# Altium schematic sheet Power_Supply.SchDoc: Power Supply
size A4; DrawnBy: hvj10; Organization: ENEL429 Group 9; Address1: ECE Department; Address2: University of Canterbury; Address3: Christchurch 8041; Address4: New Zealand; Revision: 1; SheetNumber: 3; SheetTotal: 5
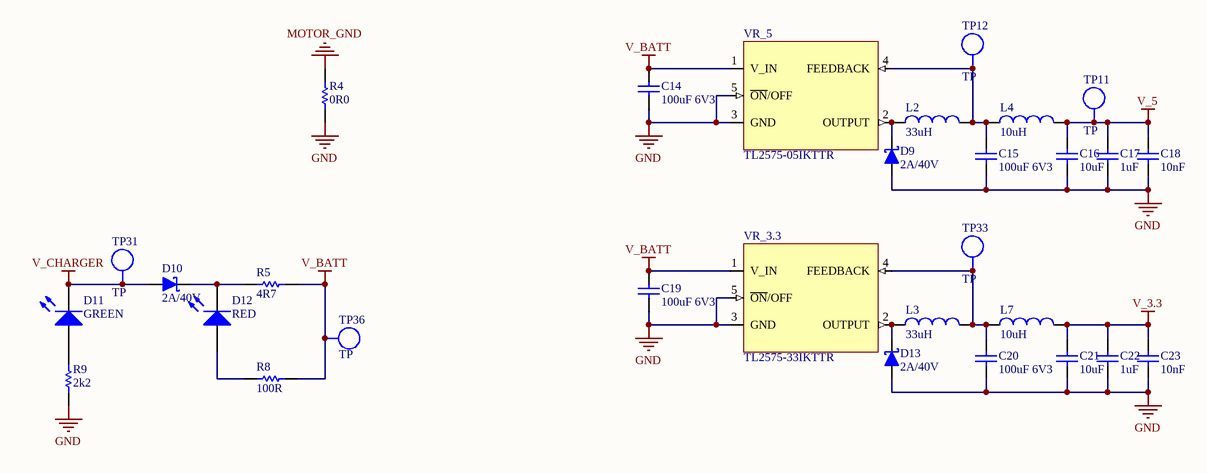
[diagram p0: Power_Supply.SchDoc]

## Parts
C14  100uF 6V3  [1206]
C15  100uF 6V3  [1206]
C16  10uF  [0805]
C17  1uF  [0603]
C18  10nF  [0603]
C19  100uF 6V3  [1206]
C20  100uF 6V3  [1206]
C21  10uF  [0805]
C22  1uF  [0603]
C23  10nF  [0603]
D9  2A/40V  [SMB_DIODE]
D10  2A/40V  [SMB_DIODE]
D11  value GREEN  [DIODE_0805]  (hidden comment: LED Green)
D12  value RED  [Diode_0805]  (hidden comment: LED Red)
D13  2A/40V  [SMB_DIODE]
L2  value 33uH  [DR124]  (hidden comment: Inductor)
L3  value 33uH  [DR124]  (hidden comment: Inductor)
L4  10uH  [WE-PD]
L7  10uH  [WE-PD]
R4  0R0  [0603]  (no BOM)
R5  4R7  [0603]
R8  100R  [0603]
R9  2k2  [0603]
TP11  TP  [TEST_POINT_4X2MM]  (no BOM)
TP12  TP  [TEST_POINT_4X2MM]  (no BOM)
TP31  TP  [TEST_POINT_4X2MM]  (no BOM)
TP33  TP  [TEST_POINT_4X2MM]  (no BOM)
TP36  TP  [TEST_POINT_4X2MM]  (no BOM)
VR_3.3  TL2575-33IKTTR  [TO170P1524X483-6N]
VR_5  TL2575-05IKTTR  [TO170P1524X483-6N]

## Nets
GND: C14.1 C15.1 C16.1 C17.1 C18.1 C19.1 C20.1 C21.1 C22.1 C23.1 D9.1(A) D13.1(A) R4.2 R9.1 VR_3.3.3(GND) VR_3.3.5(~{ON}/OFF) VR_3.3.6(GND) VR_5.3(GND) VR_5.5(~{ON}/OFF) VR_5.6(GND)
MOTOR_GND: R4.1
V_3.3: C21.2 C22.2 C23.2 L7.2
V_5: C16.2 C17.2 C18.2 L4.2 TP11.1
V_BATT: C14.2 C19.2 R5.2 R8.2 TP36.1 VR_3.3.1(V_IN) VR_5.1(V_IN)
V_CHARGER: D10.1(A) D11.2(K) TP31.1
NetC15_2: C15.2 L2.2 L4.1 TP12.1 VR_5.4(FEEDBACK)
NetC20_2: C20.2 L3.2 L7.1 TP33.1 VR_3.3.4(FEEDBACK)
NetD9_2: D9.2(K) L2.1 VR_5.2(OUTPUT)
NetD10_2: D10.2(K) D12.2(K) R5.1
NetD11_1: D11.1(A) R9.2
NetD12_1: D12.1(A) R8.1
NetD13_2: D13.2(K) L3.1 VR_3.3.2(OUTPUT)

## Notes on the sheet
- Title
- Drawn by:
- Date:
- Time:
- Revision:
- Sheet
- of
- File:

## Library data of the parts
C14 C15 C19 C20 = CP_CER 100uF_1206_6V3: 100uF 6.3V 1206 multi-layer ceramic capacitor; Manufacturer PN: C1206C107M9PACTU; Manufacturer: Kemet; Supplier Part Number 1: 399-5620-1-ND; price: 2.56; Supplier 1: Digi-Key; value: 100uF 6V3; Part Number: CP_CER 100uF_1206_6V3; Component Kind: Standard; Component Type: Standard; Designator: CP_CER 100uF_1206_6V3; Pin Count: 2
C16 C21 = CP_10uF 0805: CAP 10uF 10% 10V X5R 0805; Manufacturer: Murata; Manufacturer PN: GRM219R61A106KE44D; LatestRevisionDate: 29 May 08; Supplier 1: Digi-Key; Supplier Part Number 1: 490-4735-1-ND; Value: 10uF; Part Number: CP_10uF 0805; Component Kind: Standard; Component Type: Standard; Designator: CP_10uF 0805; Pin Count: 2
C17 C22 = CP_1uF_50V_0603: CAP CER 1.0UF 50V X7R 0603; Manufacturer: Taiyo Yuden; Manufacturer PN: UMK107C5105KA-T; Supplier Part Number 1: 445-5090-2-ND; Supplier 1: Digi-Key; Value: 1uF; Part Number: CP_1uF_50V_0603; Component Kind: Standard; Component Type: Standard; Designator: CP_1uF_50V_0603; Pin Count: 2; Signal Integrity: Cap; Simulation: CAP
C18 C23 = CP_10nF 0603: CAP CER 10000PF 100V X7R 0603; Manufacturer: Taiyo Yuden; Manufacturer PN: HMK107B7103KA-T; Supplier 1: Digi-Key; Supplier Part Number 1: 587-1446-2-ND; Value: 10nF; Part Number: CP_10nF 0603; Component Kind: Standard; Component Type: Standard; Designator: CP_10nF 0603; Pin Count: 2; Signal Integrity: Cap; Simulation: CAP
D9 D10 D13 = DS_SS230TP: Schottky Diode - 2A/30V; Manufacturer: Discrete Semiconductor Products; Manufacturer PN: SS23; Signal Integrity: D Schottky; LatestRevisionDate: 20 Feb 09; Supplier Part Number 1: SS23-TPMSCT-ND; Supplier 1: Digi-Key; Value: 2A/40V; Part Number: DS_SS230TP; Component Kind: Standard; Component Type: Standard; Designator: DS_SS230TP; Pin Count: 2; Simulation: SKYDIODE
D11 = DL_LED Green 0805: Green LED 0805; Manufacturer: Vishay; Verify: Not checked; Supplier 1: Digi-Key; Supplier Part Number 1: 160-1179-2-ND; Part Number: DL_LED Green 0805; Component Kind: Standard; Component Type: Standard; Designator: DL_LED Green 0805; Footprint: LED_RA_SMD; Pin Count: 2; Simulation: LED0
D12 = DL_LED Red 0805: Red LED 0805; Manufacturer PN: TLMS2100-GS08; Manufacturer: Vishay; Supplier 1: Digi-Key; Supplier Part Number 1: 350-2038-1-ND; Part Number: DL_LED Red 0805; Component Kind: Standard; Component Type: Standard; Designator: DL_LED Red 0805; Pin Count: 2; Simulation: LED0
L2 L3 = IN_33u 2A SMT: INDUCTOR POWER SHIELD 33UH 2.6A SMD; Manufacturer: Coiltronics; Manufacturer PN: DR124-330-R; Verify: Not Checked; LatestRevisionDate: 20 Feb 09; Supplier 1: Digi-Key; Supplier Part Number 1: 513-1435-1-ND; Part Number: IN_33u 2A SMT; Component Kind: Standard; Component Type: Standard; Designator: IN_33u 2A SMT; Pin Count: 2; Signal Integrity: Inductor; Simulation: INDUCTOR
L4 L7 = IN_10uH 2A SMT: INDUCTOR POWER 10UH 2.0A SMD; Manufacturer: Wurth Electronics Inc; Manufacturer PN: 744777910; LatestRevisionDate: 29 May 08; Supplier 1: Digi-Key; Supplier Part Number 1: 732-1191-1-ND; Value: 10uH; Part Number: IN_10uH 2A SMT; Component Kind: Standard; Component Type: Standard; Designator: IN_10uH 2A SMT; Pin Count: 2; Signal Integrity: Inductor; Simulation: INDUCTOR
R4 = RS_0R0 0603: RES 0.0 OHM 1/10W 5% 0603 SMD; Manufacturer: Rohm; Manufacturer PN: MCR03EZPJ000; LatestRevisionDate: 3 Jun 08; Supplier 1: Digi-Key; Supplier Part Number 1: RHM0.0GTR-ND; Value: 0R0; Part Number: RS_0R0 0603; Component Type: Standard (No BOM); Designator: RS_0R0 0603; Pin Count: 2; Signal Integrity: Res; Simulation: RESISTOR
R5 = RS_4R7_0603: RES 4.7R 1/10W 5% 0603 SMD; Manufacturer: Yageo; Manufacturer PN: RC0603JR-074R7L; Verify: Not Checked; LatestRevisionDate: 20 Feb 09; Supplier 1: Digi-Key; Supplier Part Number 1: 311-4.7GRTR-ND; Value: 4R7; Part Number: RS_4R7_0603; Component Kind: Standard; Component Type: Standard; Designator: RS_4R7_0603; Pin Count: 2; Signal Integrity: Res; Simulation: RESISTOR
R8 = RS_100R 0603: RES 100 OHM 1/10W 1% 0603 SMD; Manufacturer: ROHM; Manufacturer PN: MCR03EZPFX1000; LatestRevisionDate: n/a; Supplier 1: Digi-Key; Supplier Part Number 1: RHM100HTR-ND; Value: 100R; Part Number: RS_100R 0603; Component Kind: Standard; Component Type: Standard; Designator: RS_100R 0603; Pin Count: 2; Signal Integrity: Res; Simulation: RESISTOR
R9 = RS_2k2 0603: RES 2.2K OHM 1/10W 5% 0603 SMD; Manufacturer: Yageo; Manufacturer PN: RC0603JR-072K2L; LatestRevisionDate: 1 Jun 08; Supplier 1: Digi-Key; Supplier Part Number 1: 311-2.2KGRTR-ND; Value: 2k2; Part Number: RS_2k2 0603; Component Kind: Standard; Component Type: Standard; Designator: RS_2k2 0603; Pin Count: 2; Signal Integrity: Res; Simulation: RESISTOR
TP11 TP12 TP31 TP33 TP36 = TP_TESTPOINT: Test-Point; Value: TP; Part Number: TP_TESTPOINT; Component Type: Standard (No BOM); Designator: TP_TESTPOINT; Pin Count: 1; LatestRevisionDate: 29 May 08; Manufacturer PN: *; Manufacturer: *; Supplier 1: Digi-Key; Supplier Part Number 1: 5016KTR-ND
VR_3.3 = TL2575-33IKTTR: Manufacturer: TEXAS INSTRUMENTS; Manufacturer PN: TL2575-33IKTTR; Supplier 1: TI Samples; Supplier Part Number 1: TL2575-33IKTTR; Supplier 2: Digikey; Supplier Part Number 2: 296-21828-1-ND
VR_5 = TL2575-05IKTTR: Manufacturer: TEXAS INSTRUMENTS; Manufacturer PN: TL2575-05IKTTR; Supplier 1: TI Samples; Supplier Part Number 1: TL2575-05IKTTR